# EAGLE design potenciostato_last (EAGLE 9.3.0)
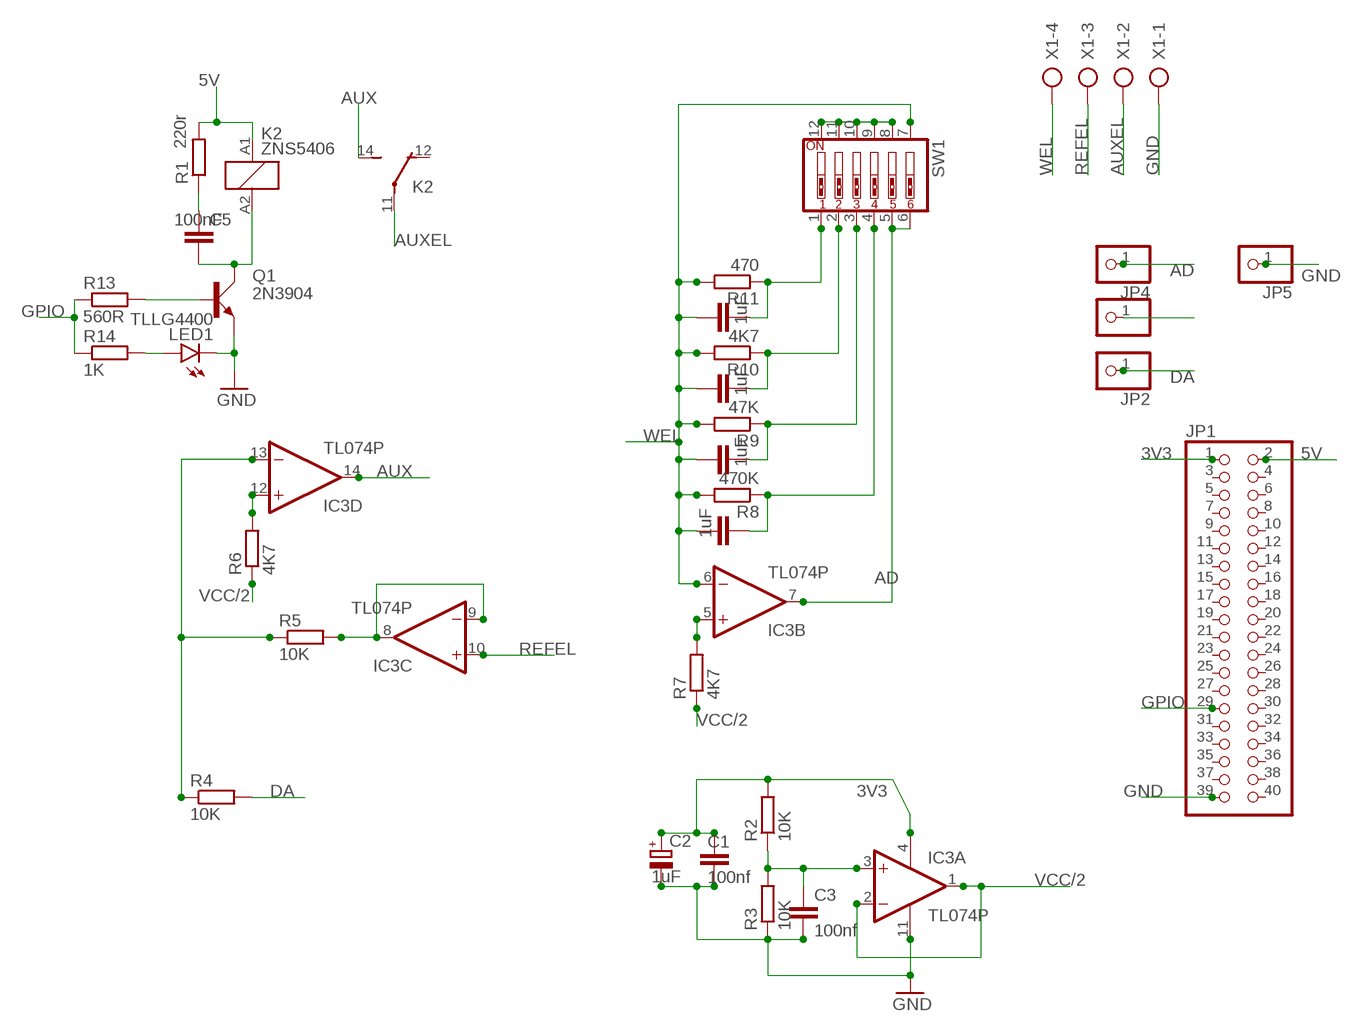
[diagram p0: schematic, sheet 1]

## Parts
C1  100nf  C-EU050-035X075  [C050-035X075]
C2  1uF  CPOL-EUE2.5-5  [E2,5-5]
C3  100nf  C-EU050-035X075  [C050-035X075]
C4  1uF  C-EU050-035X075  [C050-035X075]
C5  100nF  C-EU050-035X075  [C050-035X075]
C6  1uF  C-EU050-035X075  [C050-035X075]
C7  1uF  C-EU050-035X075  [C050-035X075]
C8  1uF  C-EU050-035X075  [C050-035X075]
IC3  TL074P  [DIL14]
JP1  PINHD-2X20/90  [2X20/90]
JP2  PINHD-1X1  [1X01]
JP3  PINHD-1X1  [1X01]
JP4  PINHD-1X1  [1X01]
JP5  PINHD-1X1  [1X01]
K2  ZNS5406  [ZN5]
LED1  TLLG4400  [LED3MM]
Q1  2N3904  [TO92D]
R1  220r  R-EU_0207/7  [0207/7]
R2  10K  R-EU_0207/7  [0207/7]
R3  10K  R-EU_0207/7  [0207/7]
R4  10K  R-EU_0207/7  [0207/7]
R5  10K  R-EU_0207/7  [0207/7]
R6  4K7  R-EU_0207/7  [0207/7]
R7  4K7  R-EU_0207/7  [0207/7]
R8  470K  R-EU_0207/7  [0207/7]
R9  47K  R-EU_0207/7  [0207/7]
R10  4K7  R-EU_0207/7  [0207/7]
R11  470  R-EU_0207/7  [0207/7]
R13  560R  R-EU_0207/7  [0207/7]
R14  1K  R-EU_0207/7  [0207/7]
SW1  SW_DIP-6  [EDG-06]
X1  AK500/4  [AK500/4]

## Nets
3V3: C1.1 C2.+ IC3.4(P:V+) JP1.1 R2.2
5V: JP1.2 K2.A1 R1.2
AD: IC3.7(B:OUT) JP4.1 SW1.5 SW1.6
AUX: IC3.14(D:OUT) K2.14(2:S)
AUXEL: K2.11(2:P) X1.2
DA: JP2.1 R4.2
GND: C1.2 C2.- C3.2 IC3.11(P:V-) JP1.39 JP5.1 LED1.K(C) Q1.E R3.1 X1.1
GPIO: JP1.29 R13.1 R14.1
N$1: C4.2 R8.1 SW1.4
N$2: IC3.8(C:OUT) IC3.9(C:-IN) R5.2
N$3: C3.1 IC3.3(A:+IN) R2.1 R3.2
N$4: IC3.13(D:-IN) R4.1 R5.1
N$5: C5.1 R1.1
N$6: IC3.12(D:+IN) R6.2
N$7: JP3.1
N$8: IC3.5(B:+IN) R7.2
N$9: SW1.8 SW1.9 SW1.10 SW1.11 SW1.12
N$10: C6.2 R11.1 SW1.1
N$11: C7.2 R10.1 SW1.2
N$12: C8.2 R9.1 SW1.3
N$15: C5.2 K2.A2 Q1.C
N$16: LED1.A R14.2
N$18: Q1.B R13.2
REFEL: IC3.10(C:+IN) X1.3
VCC/2: IC3.1(A:OUT) IC3.2(A:-IN) R6.1 R7.1
WEL: C4.1 C6.1 C7.1 C8.1 IC3.6(B:-IN) R8.2 R9.2 R10.2 R11.2 SW1.7 X1.4
Unconnected: JP1.3 JP1.4 JP1.5 JP1.6 JP1.7 JP1.8 JP1.9 JP1.10 JP1.11 JP1.12 JP1.13 JP1.14 JP1.15 JP1.16 JP1.17 JP1.18 JP1.19 JP1.20 JP1.21 JP1.22 JP1.23 JP1.24 JP1.25 JP1.26 JP1.27 JP1.28 JP1.30 JP1.31 JP1.32 JP1.33 JP1.34 JP1.35 JP1.36 JP1.37 JP1.38 JP1.40 K2.12(2:O)

## Library data of the parts
C1 C3-C8 = rcl:C-EU: CAPACITOR, European symbol; SPICEPREFIX: C
C2 = rcl:CPOL-EU: POLARIZED CAPACITOR, European symbol; SPICEPREFIX: C
IC3 = linear:TL074: OP AMP
JP1 = pinhead:PINHD-2X20: PIN HEADER
JP2-JP5 = pinhead:PINHD-1X1: PIN HEADER
K2 = relay:ZNS5*: Miniature Power PCB Relay SCHRACK 1pole 10 A Source: http://www.schrack.com/.. 5847.pdf; OC_FARNELL: unknown; OC_NEWARK: unknown
LED1 = led:TLLG4400: Low Current (2mA) LED 3 mm Tinted Diffused Package color GREEN Source: Data sheet <http://www.farnell.com/datasheets/391098.pdf>; MF: VISHAY SEMICONDUCTOR; OC_FARNELL: 1612435
Q1 = transistor-small-signal:2N3904: NPN TRANSISTOR
R1-R11 R13 R14 = rcl:R-EU_: RESISTOR, European symbol; SPICEPREFIX: R
SW1 = special:SW_DIP-6: DIP SWITCH
X1 = con-ptr500:AK500/4: CONNECTOR; OC_FARNELL: unknown; OC_NEWARK: unknown

## Board
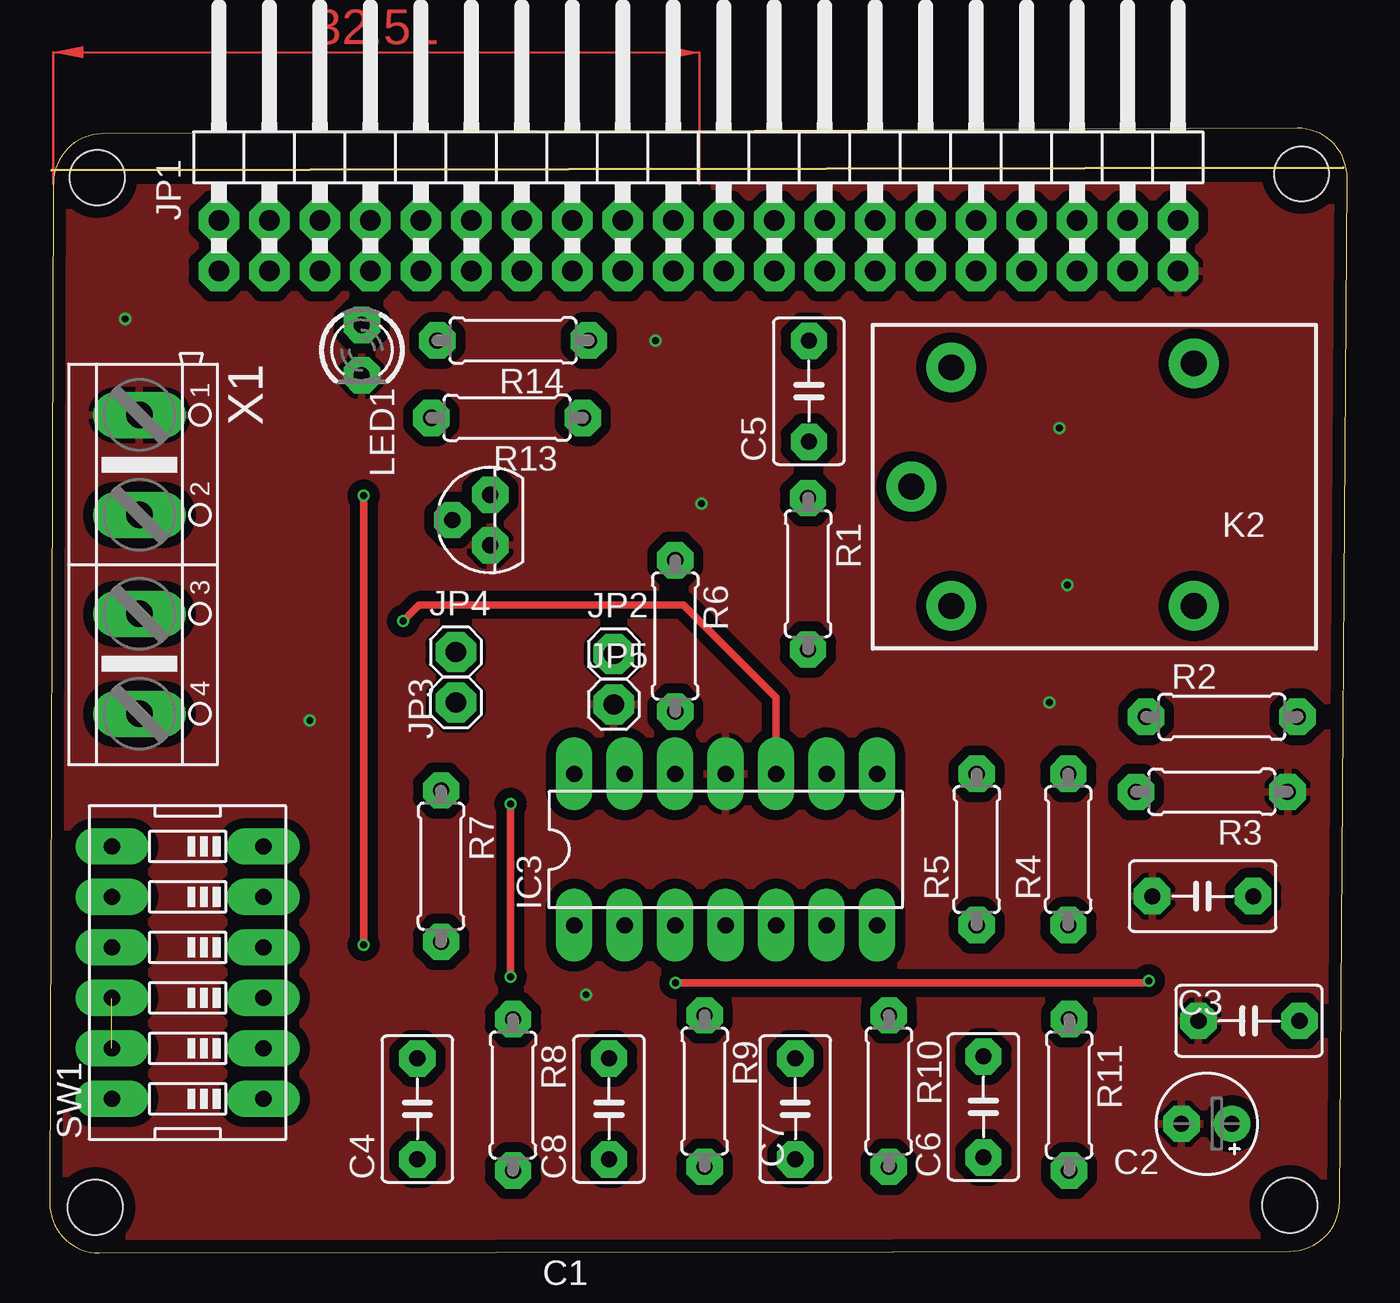
[diagram p1: board, top side]
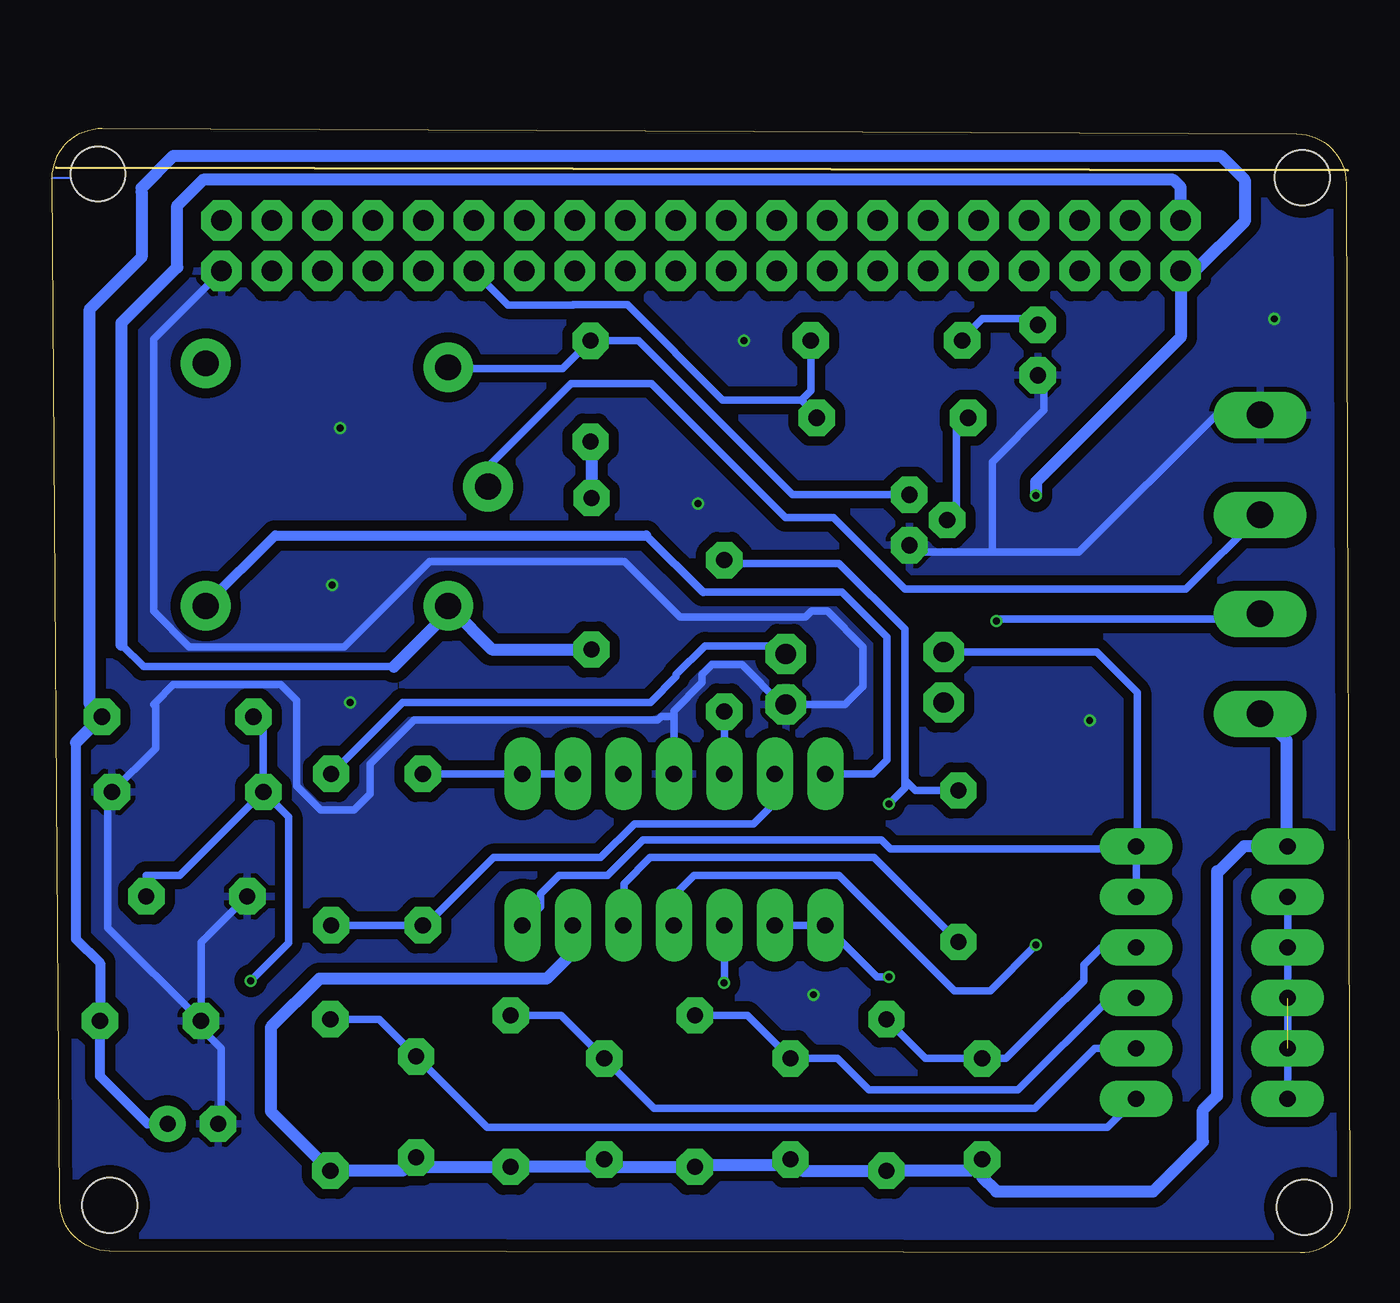
[diagram p2: board, bottom side, seen from below]

Size 65.28 x 56.59 mm. Coordinates in mm from the lower left corner, seen from the top.
Outline: 0.18,53.81 0,2.51 arc90 2.5,0 62.4,0.09 arc89 64.9,2.57 65.28,54.07 arc91 62.77,56.59 2.67,56.3 arc90 0.18,53.81
Copper layers (1*16): Top 0.035mm / dielectric 1.5mm / Bottom 0.035mm
Design rules "default *": minimum track width 15mil, minimum drill 0.35mm, track to track 20mil, track to pad 20mil, pad to pad 20mil, via to via 6mil, smd to smd 6mil, copper to edge 25mil, drill to drill 6mil, minimum pad ring 20mil, minimum via ring 5mil, stop-mask expansion 4mil, vias tented up to drill 0mil, thermal gap 10mil
Holes 2.75 mm at 2.39,54.1 62.99,54.3 2.29,2.3 62.39,2.4

### Footprints (pad centres in the part's own frame; a part is rotated, then mirrored left to right if it is on the bottom)
C050-035X075 = drill 0.813 octagon: 1 -2.54,0; 2 2.54,0
E2,5-5 = drill 0.813 pad 1.6: + -1.27,0 | drill 0.813 pad 1.6 octagon: - 1.27,0
DIL14 = drill 0.813 long: 1 -7.62,-3.81; 2 -5.08,-3.81; 3 -2.54,-3.81; 4 0,-3.81; 5 2.54,-3.81; 6 5.08,-3.81; 7 7.62,-3.81; 8 7.62,3.81; 9 5.08,3.81; 10 2.54,3.81; 11 0,3.81; 12 -2.54,3.81; 13 -5.08,3.81; 14 -7.62,3.81
2X20/90 = drill 1.016 octagon: 1 -24.13,-6.35; 2 -24.13,-3.81; 3 -21.59,-6.35; 4 -21.59,-3.81; 5 -19.05,-6.35; 6 -19.05,-3.81; 7 -16.51,-6.35; 8 -16.51,-3.81; 9 -13.97,-6.35; 10 -13.97,-3.81; 11 -11.43,-6.35; 12 -11.43,-3.81; 13 -8.89,-6.35; 14 -8.89,-3.81; 15 -6.35,-6.35; 16 -6.35,-3.81; 17 -3.81,-6.35; 18 -3.81,-3.81; 19 -1.27,-6.35; 20 -1.27,-3.81; 21 1.27,-6.35; 22 1.27,-3.81; 23 3.81,-6.35; 24 3.81,-3.81; 25 6.35,-6.35; 26 6.35,-3.81; 27 8.89,-6.35; 28 8.89,-3.81; 29 11.43,-6.35; 30 11.43,-3.81; 31 13.97,-6.35; 32 13.97,-3.81; 33 16.51,-6.35; 34 16.51,-3.81; 35 19.05,-6.35; 36 19.05,-3.81; 37 21.59,-6.35; 38 21.59,-3.81; 39 24.13,-6.35; 40 24.13,-3.81
1X01 = drill 1.016 octagon: 1 0,0
ZN5 = drill 1.3 pad 2.5: 11 8.89,0; 12 -5.31,-6.2; 14 -5.31,6; A1 6.89,6; A2 6.89,-6
LED3MM = drill 0.813 octagon: A -1.27,0; K 1.27,0
TO92D = drill 0.813 octagon: B 0,1.905; C 1.27,0; E -1.27,0
0207/7 = drill 0.813 octagon: 1 -3.81,0; 2 3.81,0
EDG-06 = drill 0.813 long: 1 -6.35,-3.81; 2 -3.81,-3.81; 3 -1.27,-3.81; 4 1.27,-3.81; 5 3.81,-3.81; 6 6.35,-3.81; 7 6.35,3.81; 8 3.81,3.81; 9 1.27,3.81; 10 -1.27,3.81; 11 -3.81,3.81; 12 -6.35,3.81
AK500/4 = drill 1.321 long: 1 -7.518,0; 2 -2.489,0; 3 2.489,0; 4 7.518,0

### Placement (x,y rotation side)
C1  60.34,11.68 180 top
C2  58.21,6.5 180 top
C3  58.01,17.95 180 top
C4  18.5,7.25 90 top
C5  ?  [C050-035X075]  38.2,43.36 90 top
C6  46.98,7.35 90 top
C7  37.51,7.25 90 top
C8  28.14,7.25 90 top
IC3  34.01,20.3 0 top
JP1  32.64,55.76 0 top
JP2  28.38,30.14 0 top
JP3  20.43,27.7 90 top
JP4  20.43,30.24 0 top
JP5  28.38,27.6 0 top
K2  52.25,38.56 180 top
LED1  15.7,45.43 270 top
Q1  22.16,36.88 90 top
R1  ?  [0207/7]  38.15,34.17 270 top
R2  58.97,26.98 0 top
R3  58.47,23.2 180 top
R4  51.25,20.3 90 top
R5  46.64,20.3 90 top
R6  31.47,31.05 270 top
R7  19.69,19.46 270 top
R8  23.31,7.95 270 top
R9  32.95,8.15 270 top
R10  42.22,8.15 270 top
R11  51.29,7.95 270 top
R13  23.01,42.02 180 top
R14  23.31,45.91 180 top
SW1  6.94,14.11 90 top
X1  4.51,34.65 270 top

### Tracks (layer width: path | path; a pad name or v marks a point on that pad's centre or on a via)
3V3  (via drill 0.35)
  Top 0.381: v15.79,38.1 v15.79,15.5
  Bottom 0.381: R2.2 62.28,26.98 | JP1.1 | IC3.4 34.01,17.98 32.99,19 25.69,19 19.89,13.2 18.09,13.2 v15.79,15.5 | C2.+ 60.49,6.5 | 60.79,53.6 60.79,53.39 60.79,53.38
  Bottom 0.508: 64.09,25.67 64.09,15.8 62.88,14.59 C1.1 62.88,8.89 60.49,6.5
  Bottom 0.61: JP1.1 8.51,46.08 15.79,38.8 v15.79,38.1 | JP1.1 7.78,49.41 5.29,51.9 5.29,54 6.49,55.2 59.19,55.2 60.79,53.6 | 64.09,25.67 R2.2 63.39,27.59 63.39,47.5 60.79,50.1 60.79,53.38
5V
  Bottom 0.381: R1.2 39.25,30.36 | K2.A1 45.2,32.39 | 48.09,29.5 60.69,29.5 61.79,30.6
  Bottom 0.61: R1.2 43.17,30.36 45.2,32.39 48.09,29.5 | JP1.2 8.51,53.62 8.89,54 57.69,54 58.99,52.7 58.99,49.6 61.79,46.8 61.79,30.6
AD
  Bottom 0.381: SW1.5 SW1.6 | 10.75,20.7 SW1.6 | IC3.7 40.7,17.41 40.7,18.07 39.78,19 37.35,19 35.57,20.79 23.57,20.79 23.12,20.33 10.88,20.33 SW1.6 | SW1.6 10.69,20.46 10.69,28.2 12.73,30.24 JP4.1
AUX
  Bottom 0.381: K2.14 57.56,32.61 | 25.89,24.61 IC3.14 23.99,24.11 23.29,24.81 23.29,31 25.54,33.25 32.54,33.25
  Bottom 0.406: 35.4,36.1 32.54,33.25
  Bottom 0.508: 57.56,32.61 54.07,36.1 35.4,36.1
AUXEL
  Bottom 0.381: K2.11 43.36,39.56 39.19,43.73 35.12,43.73 28.39,37 25.99,37 22.39,33.4 8.25,33.4 X1.2 4.55,37.1
DA
  Bottom 0.381: R4.2 47.66,27.7 35.19,27.7 33.89,29 33.89,29.1 32.44,30.55 28.38,30.55 JP2.1
GND  (via drill 0.35)
  Bottom 0.381: C3.2 57.8,15.62 C1.2 | IC3.11 34.01,27 | 34.01,27 34.01,27.28 32.59,28.7 32.59,29.1 32.09,29.6 30.59,29.6 28.59,27.6 JP5.1 25.39,27.6 24.49,28.5 24.49,30.5 26.29,32.3 27.09,32.3 27.39,32 33.69,32 36.49,34.8 46.29,34.8 50.59,30.5 58.39,30.5 60.19,32.3 60.19,45.99 JP1.39 | C1.2 57.68,11.8 | X1.1 6.72,42.16 13.62,35.26 17.99,35.26 | 17.99,35.26 21.82,35.26 Q1.E | 17.99,35.26 17.99,39.8 15.39,42.4 15.39,43.85 LED1.K | 34.01,27 34.63,27 34.82,26.81 47.08,26.81 49.29,24.6 49.29,23.1 50.09,22.3 51.79,22.3 52.99,23.5 52.99,27.8 53.79,28.6 59.19,28.6 60.09,27.7 | 60.09,27.7 60.19,27.6 | 60.09,27.7 60.09,25.39 R3.1 62.49,22.99 62.49,16.37 C1.2 | C1.2 57.8,11.31 56.79,10.3 56.79,6.65 C2.-
  other vias: 13.09,26.8 26.99,13 50.29,27.7 51.19,33.6 50.79,41.5 32.79,37.7 30.49,45.9 3.79,47
  pour Bottom: 1.8,56.2 64.24,56.2 arc-90 64.99,55.45 64.99,1.68 arc-90 63.51,0.2 2.59,0.2 arc-90 0.09,2.7 0.09,54.49 arc-90
  pour Top: 0.39,55.8 arc90 -0.11,55.3 -0.11,2.9 arc90 2.89,-0.1 62.79,-0.1 arc90 64.99,2.1 64.99,54.4 arc90 62.89,56.5 1.59,56.5 0.99,56.5 0.39,55.9
GPIO
  Bottom 0.381: JP1.29 42.36,47.7 39.08,47.7 39.07,47.71 36.35,47.71 31.55,42.92 27.59,42.92 | R14.1 27.12,43.39 27.59,42.92 | R13.1 26.82,42.15 27.59,42.92
N$1
  Bottom 0.381: R8.1 21.34,9.79 C4.2 17.3,9.79 15.49,11.6 15.29,11.8 13.39,13.7 13.39,14.5 12.51,15.38 SW1.4
N$2
  Bottom 0.381: R5.2 IC3.8 IC3.9
N$3  (via drill 0.35)
  Top 0.381: 31.47,13.62 v31.49,13.6 55.19,13.6 v55.29,13.7
  Bottom 0.381: R2.1 54.66,26.48 R3.2 | R3.2 58.86,19 60.55,19 C3.1 | v55.29,13.7 53.39,15.6 53.39,21.93 R3.2 | IC3.3 31.47,13.62 v31.49,13.6
N$4
  Bottom 0.381: R4.1 R5.1 46.5,16.49 43.09,19.9 37.69,19.9 35.99,21.6 29.99,21.6 28.93,22.66 IC3.13
N$5
  Bottom 0.381: C5.1 38.15,40.77
  Bottom 0.61: 38.15,40.77 R1.1
N$6
  Bottom 0.381: R6.2 IC3.12
N$8
  Bottom 0.381: IC3.5 36.52,16.51 36.52,18.57 35.2,19.9 23.94,19.9 R7.2
N$9  (1 unrouted)
  Bottom 0.381: SW1.8 SW1.9 SW1.12 SW1.11 | SW1.10 3.13,12.8
N$10
  Bottom 0.381: R11.1 48.85,11.76 C6.2 43.41,6.32 12.19,6.32 SW1.1
N$11
  Bottom 0.381: R10.1 39.68,11.96 C7.2 35.01,7.28 15.85,7.28 12.83,10.3 SW1.2
N$12
  Bottom 0.381: R9.1 30.31,11.96 C8.2 25.78,9.79 24.19,8.2 16.69,8.2 12.05,12.84 SW1.3
N$15
  Bottom 0.381: K2.A2 45.3,44.5 39.6,44.5 C5.2 35.79,45.9 28.04,38.15 Q1.C
N$16
  Bottom 0.381: R14.2 19.5,45.99 18.49,47 16,47 LED1.A
N$18
  Bottom 0.381: R13.2 19.79,41.43 19.79,37.34 Q1.B
REFEL  (via drill 0.35)
  Top 0.381: IC3.10 36.55,27.94 31.89,32.6 18.59,32.6 v17.79,31.8
  Bottom 0.381: v17.79,31.8 17.69,31.9 4.77,31.9 X1.3
VCC/2  (via drill 0.35)
  Top 0.381: v23.19,13.9 v23.19,22.6
  Bottom 0.381: IC3.2 IC3.1 | 25.97,16.49 IC3.1 | R6.1 31.31,34.7 25.69,34.7 22.39,31.4 22.39,23.8 | 22.39,23.8 21.86,23.27 R7.1 | IC3.1 23.8,13.9 v23.19,13.9 23.09,13.9 | 22.59,23.2 v23.19,22.6 22.39,23.4 22.39,23.8
WEL
  Bottom 0.381: 3.33,20.46 3.19,20.46 SW1.7 | X1.4 3.83,26.45 | 32.85,4.44 R9.2 | 37.14,4.34 C7.1 37.51,4.34 | 46.51,4.34 C6.1 47.65,4.14 | 39.29,16.29 IC3.6 39.12,16.46 | 6.59,19.2 6.69,19.2 | C8.1 28.41,4.44
  Bottom 0.61: C8.1 27.57,4.14 R8.2 19.07,4.14 C4.1 18.5,3.81 17.79,3.1 9.89,3.1 7.39,5.6 7.39,7.2 6.69,7.9 6.69,19.2 | 32.85,4.44 28.41,4.44 | 37.14,4.34 R9.2 | 37.51,4.34 R10.2 46.51,4.34 | 47.65,4.14 R11.2 54.29,7.14 54.29,11.34 51.83,13.8 40.43,13.8 39.12,15.1 39.12,16.46 | 3.33,20.46 5.33,20.46 6.59,19.2 | X1.4 3.19,25.81 3.19,20.46
(copper drawn outside any net)
  shapes: Bottom area x1, Top area x1